# EAGLE design BGHESP32_Base_v1.1 (EAGLE 9.6.2)
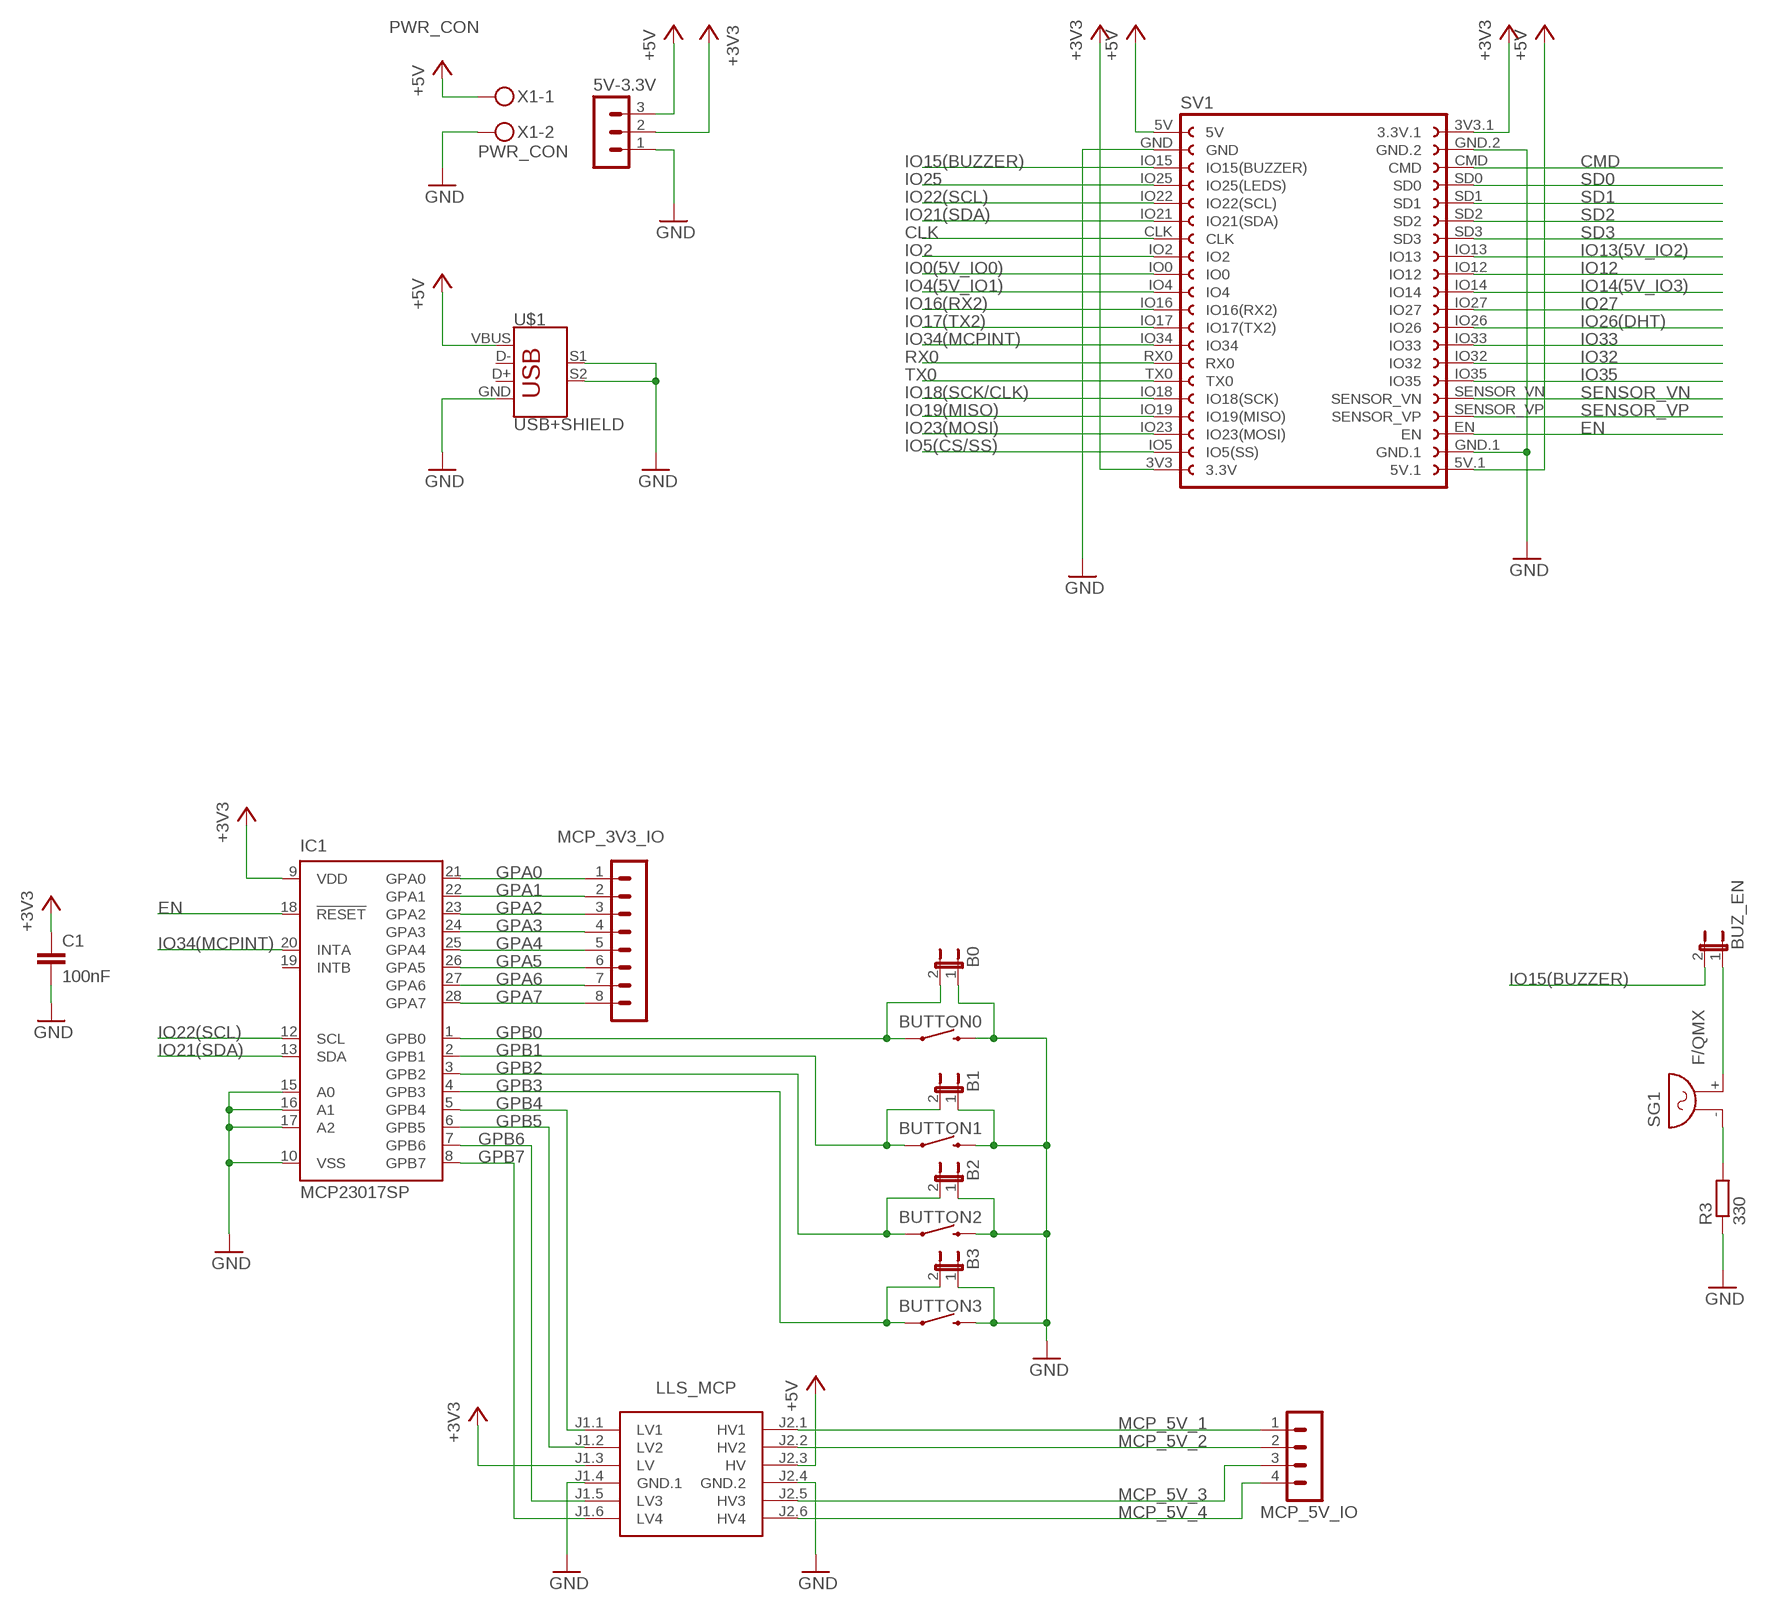
[diagram p0: schematic, sheet 1, part 1 of 2]
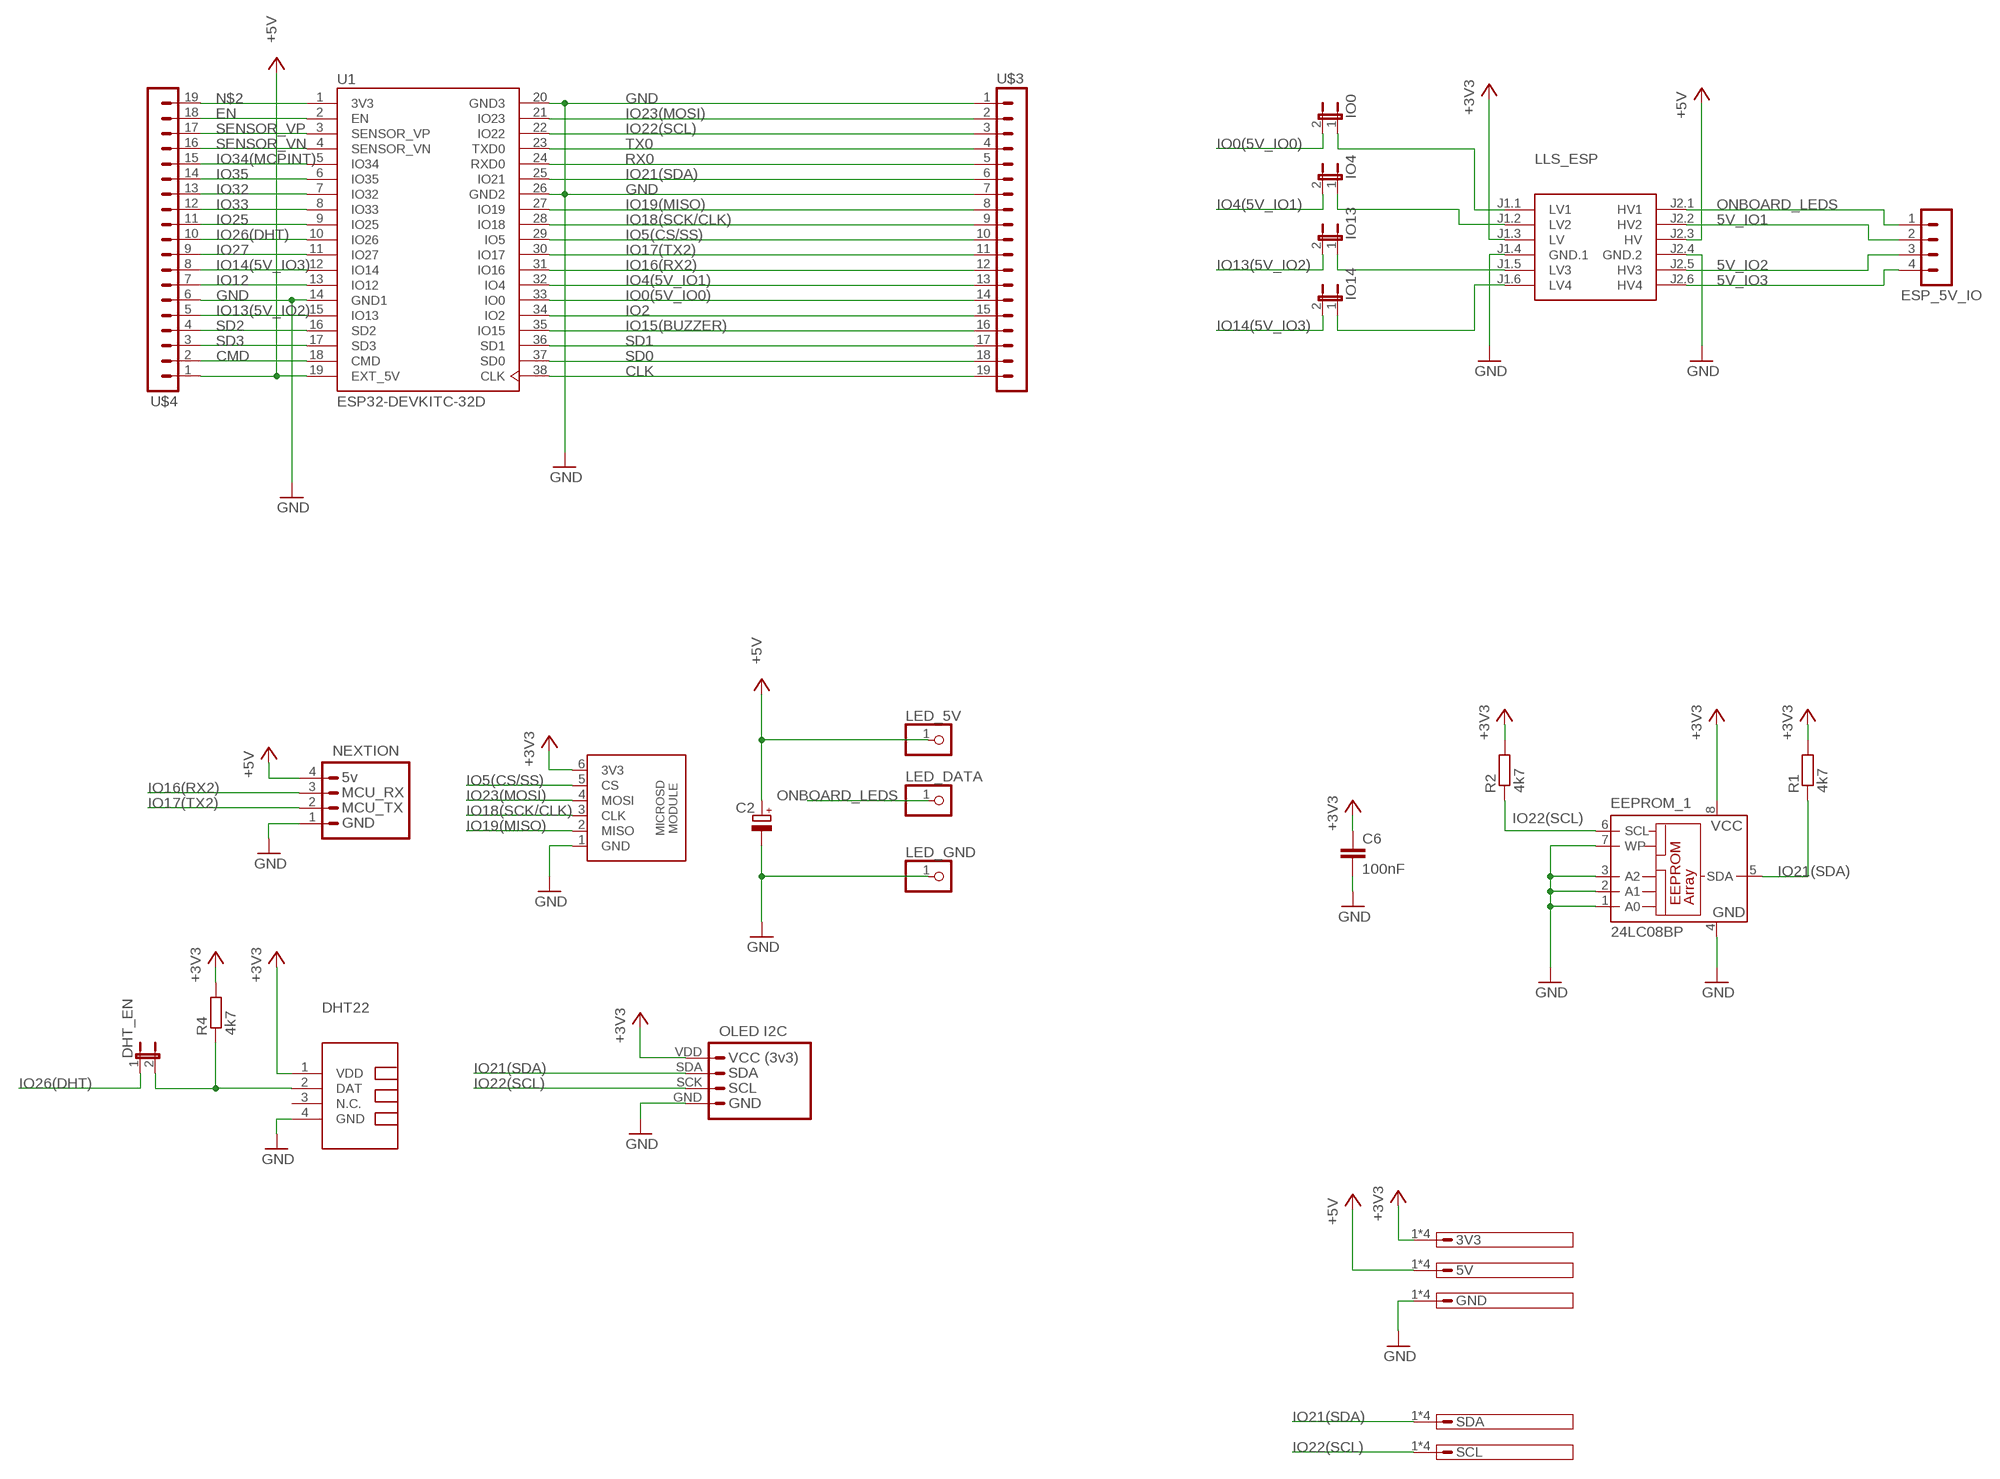
[diagram p1: schematic, sheet 1, part 2 of 2]

## Parts
3V3  IO-OUT-4PIO-OUT-4[  [IO-OUT-4P]
5V  IO-OUT-4PIO-OUT-4[  [IO-OUT-4P]
5V-3.3V  MA03-1  [MA03-1]
B0  JP1E  [JP1]
B1  JP1E  [JP1]
B2  JP1E  [JP1]
B3  JP1E  [JP1]
BUTTON0  MOMENTARY-SWITCH-SPST-PTH-6.0MM  [TACTILE_SWITCH_PTH_6.0MM]
BUTTON1  MOMENTARY-SWITCH-SPST-PTH-6.0MM  [TACTILE_SWITCH_PTH_6.0MM]
BUTTON2  MOMENTARY-SWITCH-SPST-PTH-6.0MM  [TACTILE_SWITCH_PTH_6.0MM]
BUTTON3  MOMENTARY-SWITCH-SPST-PTH-6.0MM  [TACTILE_SWITCH_PTH_6.0MM]
BUZ_EN  JP1E  [JP1]
C1  100nF  C-EU050-025X075  [C050-025X075]
C2  CPOL-EUE5-10.5  [E5-10,5]
C6  100nF  C-EU050-025X075  [C050-025X075]
DHT22  TEMP-HUM-SENSOR-DHT22  [TEMP-HUM-SENSOR-DHT22]
DHT_EN  JP1E  [JP1]
EEPROM_1  24LC08BP  [DIL8]
ESP_5V_IO  MA04-1  [MA04-1]
GND  IO-OUT-4PIO-OUT-4[  [IO-OUT-4P]
IC1  MCP23017SP  [DIL28-3]
IO0  JP1E  [JP1]
IO4  JP1E  [JP1]
IO13  JP1E  [JP1]
IO14  JP1E  [JP1]
LED_5V  PINHD-1X1  [1X01]
LED_DATA  PINHD-1X1  [1X01]
LED_GND  PINHD-1X1  [1X01]
LLS_ESP  LEVEL-SHIFTER-4CH  [LEVEL-SHIFTER-4CH]
LLS_MCP  LEVEL-SHIFTER-4CH  [LEVEL-SHIFTER-4CH]
MCP_3V3_IO  MA08-1  [MA08-1]
MCP_5V_IO  MA04-1  [MA04-1]
R1  4k7  R-EU_0207/10  [0207/10]
R2  4k7  R-EU_0207/10  [0207/10]
R3  330  R-EU_0207/10  [0207/10]
R4  4k7  R-EU_0207/10  [0207/10]
SCL  IO-OUT-4PIO-OUT-4[  [IO-OUT-4P]
SDA  IO-OUT-4PIO-OUT-4[  [IO-OUT-4P]
SG1  F/QMX  [F/QMX]
SV1  DAUGHTERBOARD_CON  [DAUGHTERBOARD_CON]
SV3  NEXTION_CON  [NEXTION_CON]
U1  ESP32-DEVKITC-32D  [MODULE_ESP32-DEVKITC-32D]
U$1  USB+SHIELD  [USB-B-PTH]
U$2  I2C_OLED  [I2C_OLED]
U$3  MA19-1  [MA19-1]
U$4  MA19-1  [MA19-1]
U$5  SDCARD_MODULE  [SDCARD_MODULE]
X1  PWR_CON  MKDSN1,5/2-5,08  [MKDSN1,5/2-5,08]

## Nets
5V_IO1: ESP_5V_IO.2 LLS_ESP.J2.2(HV2)
5V_IO2: ESP_5V_IO.3 LLS_ESP.J2.5(HV3)
5V_IO3: ESP_5V_IO.4 LLS_ESP.J2.6(HV4)
+3V3: 3V3.1 3V3.2 3V3.3 3V3.4 5V-3.3V.2 C1.1 C6.1 DHT22.1(VDD) EEPROM_1.8(VCC) IC1.9(VDD) LLS_ESP.J1.3(LV) LLS_MCP.J1.3(LV) R1.2 R2.2 R4.2 SV1.3V3(3.3V) SV1.3V3.1(3.3V.1) U$2.VDD(VCC) U$5.6(3V3)
+5V: 5V-3.3V.3 5V.1 5V.2 5V.3 5V.4 C2.+ LED_5V.1 LLS_ESP.J2.3(HV) LLS_MCP.J2.3(HV) SV1.5V SV1.5V.1 SV3.4 U1.19(EXT_5V) U$1.VBUS U$4.1 X1.1
CLK: SV1.CLK U1.38(CLK) U$3.19
CMD: SV1.CMD U1.18(CMD) U$4.2
EN: IC1.18(!RESET) SV1.EN U1.2(EN) U$4.18
GND: 5V-3.3V.1 B0.1 B1.1 B2.1 B3.1 BUTTON0.3 BUTTON1.3 BUTTON2.3 BUTTON3.3 C1.2 C2.- C6.2 DHT22.4(GND) EEPROM_1.1(A0) EEPROM_1.2(A1) EEPROM_1.3(A2) EEPROM_1.4(GND) EEPROM_1.7(WP) GND.1 GND.2 GND.3 GND.4 IC1.10(VSS) IC1.15(A0) IC1.16(A1) IC1.17(A2) LED_GND.1 LLS_ESP.J1.4(GND.1) LLS_ESP.J2.4(GND.2) LLS_MCP.J1.4(GND.1) LLS_MCP.J2.4(GND.2) R3.1 SV1.GND SV1.GND.1 SV1.GND.2 SV3.1 U1.14(GND1) U1.20(GND3) U1.26(GND2) U$1.GND U$1.S1 U$1.S2 U$2.GND U$3.1 U$3.7 U$4.6 U$5.1(GND) X1.2
GPA0: IC1.21(GPA0) MCP_3V3_IO.1
GPA1: IC1.22(GPA1) MCP_3V3_IO.2
GPA2: IC1.23(GPA2) MCP_3V3_IO.3
GPA3: IC1.24(GPA3) MCP_3V3_IO.4
GPA4: IC1.25(GPA4) MCP_3V3_IO.5
GPA5: IC1.26(GPA5) MCP_3V3_IO.6
GPA6: IC1.27(GPA6) MCP_3V3_IO.7
GPA7: IC1.28(GPA7) MCP_3V3_IO.8
GPB0: B0.2 BUTTON0.1 IC1.1(GPB0)
GPB1: B1.2 BUTTON1.1 IC1.2(GPB1)
GPB2: B2.2 BUTTON2.1 IC1.3(GPB2)
GPB3: B3.2 BUTTON3.1 IC1.4(GPB3)
GPB4: IC1.5(GPB4) LLS_MCP.J1.1(LV1)
GPB5: IC1.6(GPB5) LLS_MCP.J1.2(LV2)
GPB6: IC1.7(GPB6) LLS_MCP.J1.5(LV3)
GPB7: IC1.8(GPB7) LLS_MCP.J1.6(LV4)
IO0(5V_IO0): IO0.2 SV1.IO0 U1.33(IO0) U$3.14
IO2: SV1.IO2 U1.34(IO2) U$3.15
IO4(5V_IO1): IO4.2 SV1.IO4 U1.32(IO4) U$3.13
IO5(CS/SS): SV1.IO5(IO5(SS)) U1.29(IO5) U$3.10 U$5.5(CS)
IO12: SV1.IO12 U1.13(IO12) U$4.7
IO13(5V_IO2): IO13.2 SV1.IO13 U1.15(IO13) U$4.5
IO14(5V_IO3): IO14.2 SV1.IO14 U1.12(IO14) U$4.8
IO15(BUZZER): BUZ_EN.2 SV1.IO15(IO15(BUZZER)) U1.35(IO15) U$3.16
IO16(RX2): SV1.IO16(IO16(RX2)) SV3.3 U1.31(IO16) U$3.12
IO17(TX2): SV1.IO17(IO17(TX2)) SV3.2 U1.30(IO17) U$3.11
IO18(SCK/CLK): SV1.IO18(IO18(SCK)) U1.28(IO18) U$3.9 U$5.3(CLK)
IO19(MISO): SV1.IO19(IO19(MISO)) U1.27(IO19) U$3.8 U$5.2(MISO)
IO21(SDA): EEPROM_1.5(SDA) IC1.13(SDA) R1.1 SDA.1 SDA.2 SDA.3 SDA.4 SV1.IO21(IO21(SDA)) U1.25(IO21) U$2.SDA U$3.6
IO22(SCL): EEPROM_1.6(SCL) IC1.12(SCL) R2.1 SCL.1 SCL.2 SCL.3 SCL.4 SV1.IO22(IO22(SCL)) U1.22(IO22) U$2.SCK(SCL) U$3.3
IO23(MOSI): SV1.IO23(IO23(MOSI)) U1.21(IO23) U$3.2 U$5.4(MOSI)
IO25: SV1.IO25(IO25(LEDS)) U1.9(IO25) U$4.11
IO26(DHT): DHT_EN.1 SV1.IO26 U1.10(IO26) U$4.10
IO27: SV1.IO27 U1.11(IO27) U$4.9
IO32: SV1.IO32 U1.7(IO32) U$4.13
IO33: SV1.IO33 U1.8(IO33) U$4.12
IO34(MCPINT): IC1.20(INTA) SV1.IO34 U1.5(IO34) U$4.15
IO35: SV1.IO35 U1.6(IO35) U$4.14
MCP_5V_1: LLS_MCP.J2.1(HV1) MCP_5V_IO.1
MCP_5V_2: LLS_MCP.J2.2(HV2) MCP_5V_IO.2
MCP_5V_3: LLS_MCP.J2.5(HV3) MCP_5V_IO.3
MCP_5V_4: LLS_MCP.J2.6(HV4) MCP_5V_IO.4
N$1: R3.2 SG1.-
N$2: U1.1(3V3) U$4.19
N$11: IO0.1 LLS_ESP.J1.1(LV1)
N$12: DHT22.2(DAT) DHT_EN.2 R4.1
N$18: IO4.1 LLS_ESP.J1.2(LV2)
N$21: BUZ_EN.1 SG1.+
N$23: IO13.1 LLS_ESP.J1.5(LV3)
N$24: IO14.1 LLS_ESP.J1.6(LV4)
ONBOARD_LEDS: ESP_5V_IO.1 LED_DATA.1 LLS_ESP.J2.1(HV1)
RX0: SV1.RX0 U1.24(RXD0) U$3.5
SD0: SV1.SD0 U1.37(SD0) U$3.18
SD1: SV1.SD1 U1.36(SD1) U$3.17
SD2: SV1.SD2 U1.16(SD2) U$4.4
SD3: SV1.SD3 U1.17(SD3) U$4.3
SENSOR_VN: SV1.SENSOR_VN U1.4(SENSOR_VN) U$4.16
SENSOR_VP: SV1.SENSOR_VP U1.3(SENSOR_VP) U$4.17
TX0: SV1.TX0 U1.23(TXD0) U$3.4
Unconnected: DHT22.3(N.C.) IC1.19(INTB) U$1.D+ U$1.D-

## Library data of the parts
3V3 5V GND SCL SDA = BGH:IO-OUT-4P
5V-3.3V = con-lstb2:MA03-1: PIN HEADER; OC_FARNELL: unknown; OC_NEWARK: unknown
B0 B1-B3 BUZ_EN DHT_EN IO0 IO4 IO13 IO14 = jumper:JP1E: JUMPER
BUTTON0 BUTTON1-BUTTON3 = SparkFun-Switches:MOMENTARY-SWITCH-SPST: Momentary Switch (Pushbutton) - SPST Normally-open (NO) SPST momentary switches (buttons, pushbuttons). Variants PTH-12MM - 12mm square, through-hole Momentary Pushbutton Switch - 12mm Square <https://www.sparkfun.com/products/9190> (COM-09190) PTH-6.0MM, PTH-6.0MM-KIT - 6.0mm square, through-hole Mini Pushbutton Switch <https://www.sparkfun.com/products/97> (COM-00097) KIT package intended for soldering kit's - only one side of pads' copper is exposed. PTH-RIGHT-ANGLE-KIT - Right-angle, through-hole Right Angle Tactile Button <https://www.sparkfun.com/products/10791> - Used on SparkFun BigTime Watch Kit <https://www.sparkfun.com/products/11734> SMD-12MM - 12mm square, surface-mount Tactile Button - SMD (12mm) <https://www.sparkfun.com/products/12993> (COM-12993) Used on SparkFun PicoBoard <https://www.sparkfun.com/products/11888> SMD-4.5MM - 4.5mm Square Trackball Switch Used on SparkFun Blackberry Trackballer Breakout <https://www.sparkfun.com/products/13169> SMD-4.6MMX2.8MM - 4.60mm x 2.80mm, surface mount Used on SparkFun SAMD21 Mini Breakout <https://www.sparkfun.com/products/13664> SMD-5.2MM, SMD-5.2-REDUNDANT - 5.2mm square, surface-mount Mini Pushbutton Switch - SMD <https://www.sparkfun.com/products/8720> (COM-08720) Used on Arduino Pro Mini <https://www.sparkfun.com/products/11114> REDUNDANT package connects both switch circuits together SMD-6.0X3.5MM - 6.0 x 3.5mm, surface mount Momentary Reset Switch SMD <https://www.sparkfun.com/products/8229> (COM-08229) SMD-6.2MM-TALL - 6.2mm square, surface mount Tactile Button - SMD (6mm) <https://www.sparkfun.com/products/12992> Used on SparkFun Digital Sandbox <https://www.sparkfun.com/products/12651> SMD-RIGHT-ANGLE - Right-angle, surface mount Used on SparkFun Block for Intel® Edison - Arduino <https://www.sparkfun.com/products/13036>; PROD_ID: SWCH-08441; SF_SKU: COM-00097
C1 C6 = rcl:C-EU: CAPACITOR, European symbol; SPICEPREFIX: C
C2 = rcl:CPOL-EU: POLARIZED CAPACITOR, European symbol; SPICEPREFIX: C
DHT22 = diy-modules:TEMP-HUM-SENSOR-DHT22: DHT22 - digital humidity & temperature sensor Also known as: AM2302 AM2302 datasheet available here: http://akizukidenshi.com/download/ds/aosong/AM2302.pdf Click here to find device on ebay.com <http://www.ebay.com/sch/dht22+digital+sensor>
EEPROM_1 = microchip:24*: Serial EEPROM I2C; MF: MICROCHIP; MPN: 24LC08B/P; OC_FARNELL: 1084245; OC_NEWARK: 96K4073
ESP_5V_IO MCP_5V_IO = con-lstb2:MA04-1: PIN HEADER; OC_FARNELL: unknown; OC_NEWARK: unknown
IC1 = microchip:MCP23017: http://ww1.microchip.com/downloads/en/DeviceDoc/21952a.pdf Source: http://ww1.microchip.com/downloads/en/DeviceDoc/21952a.pdf; MF: MICROCHIP; MPN: MCP23017-E/SP; OC_FARNELL: 1332088; OC_NEWARK: 31K2959
LED_5V LED_DATA LED_GND = adafruit:PINHD-1X1: Pin header 1x1 for 0.1" spacing With round pins
LLS_ESP LLS_MCP = diy-modules:LEVEL-SHIFTER-4CH: 4-Channel Bi-Directional Logic Level Converter based on BSS128 transistors Click here to find device on ebay.com <http://www.ebay.com/sch/i2c+logic+converter+module>
MCP_3V3_IO = con-lstb2:MA08-1: PIN HEADER; OC_FARNELL: unknown; OC_NEWARK: unknown
R1-R4 = rcl:R-EU_: RESISTOR, European symbol; SPICEPREFIX: R
SG1 = buzzer:F/QMX: BUZZER Source: Buerklin; OC_FARNELL: unknown; OC_NEWARK: unknown
SV1 = BGH:DAUGHTERBOARD_CON: BGHPCB32_DAUGHTER_CON
SV3 = BGH:NEXTION_CON: PIN HEADER; OC_FARNELL: unknown; OC_NEWARK: unknown
U1 = ESP32-DEVKITC-32D:ESP32-DEVKITC-32D: Eval Board For Esp-Wroom-32; AVAILABILITY: Unavailable; DESCRIPTION: - Transceiver; 802.11 b/g/n _Wi-Fi, WiFi, WLAN_, Bluetooth® Smart Ready 4.x Dual Mode For Use With ESP-WROOM-32; MF: Espressif Systems; MP: ESP32-DEVKITC-32D; PACKAGE: None; PRICE: None
U$1 = SparkFun-Retired:USB+SHIELD: USB+Shield USB connector with shield pins connectable
U$2 = BGH:I2C_OLED: OLED I2C 128x64 (https://www.aliexpress.com/item/32896971385.html?spm=a2g0s.9042311.0.0.17e74c4dSP5ZpN)
U$3 U$4 = BGH:MA19-1
U$5 = BGH:SDCARD_MODULE: micro sd card module
X1 = con-phoenix-508:MKDSN1,5/2-5,08: MKDSN 1,5/ 2-5,08 Printklemme Nennstrom: 13,5 A Nennspannung: 250 V Rastermaß: 5,08 mm Polzahl: 2 Anschlussart: Schraubanschluss Montage: Löten Anschlussrichtung Leiter/Platine: 0 ° Artikelnummer: 1729128 Source: http://eshop.phoenixcontact.com .. 1729128.pdf

## Board
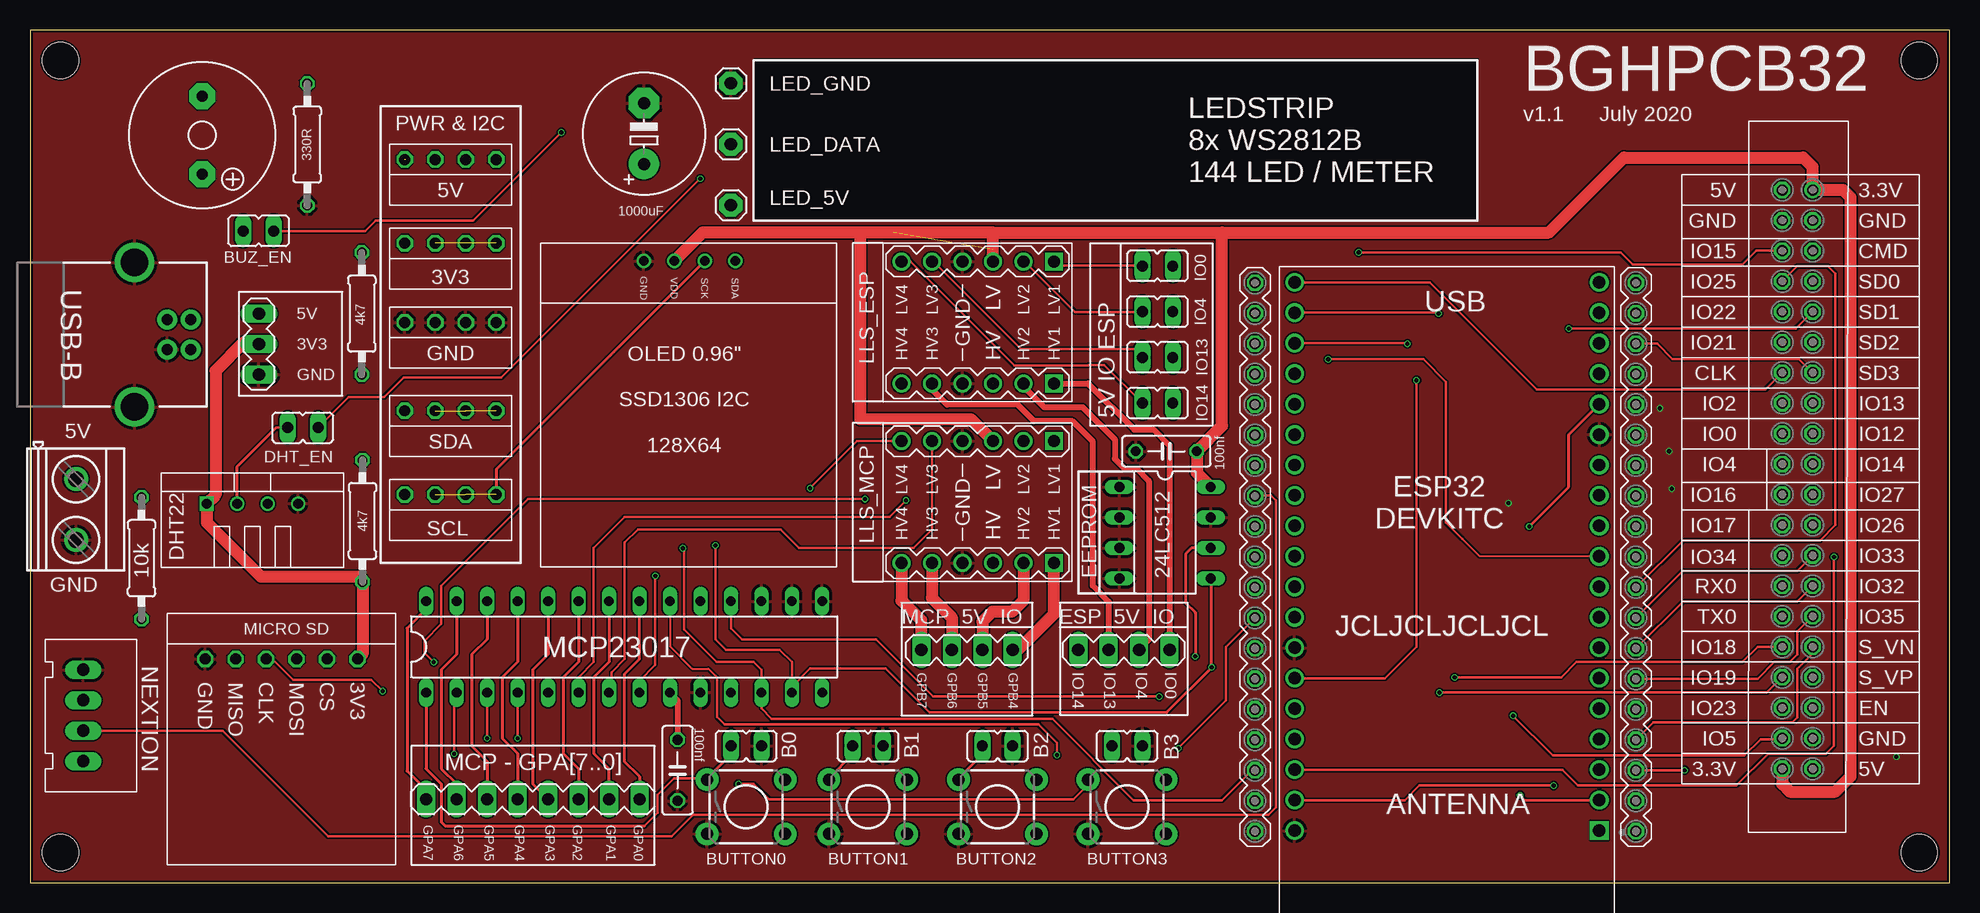
[diagram p2: board, top side]
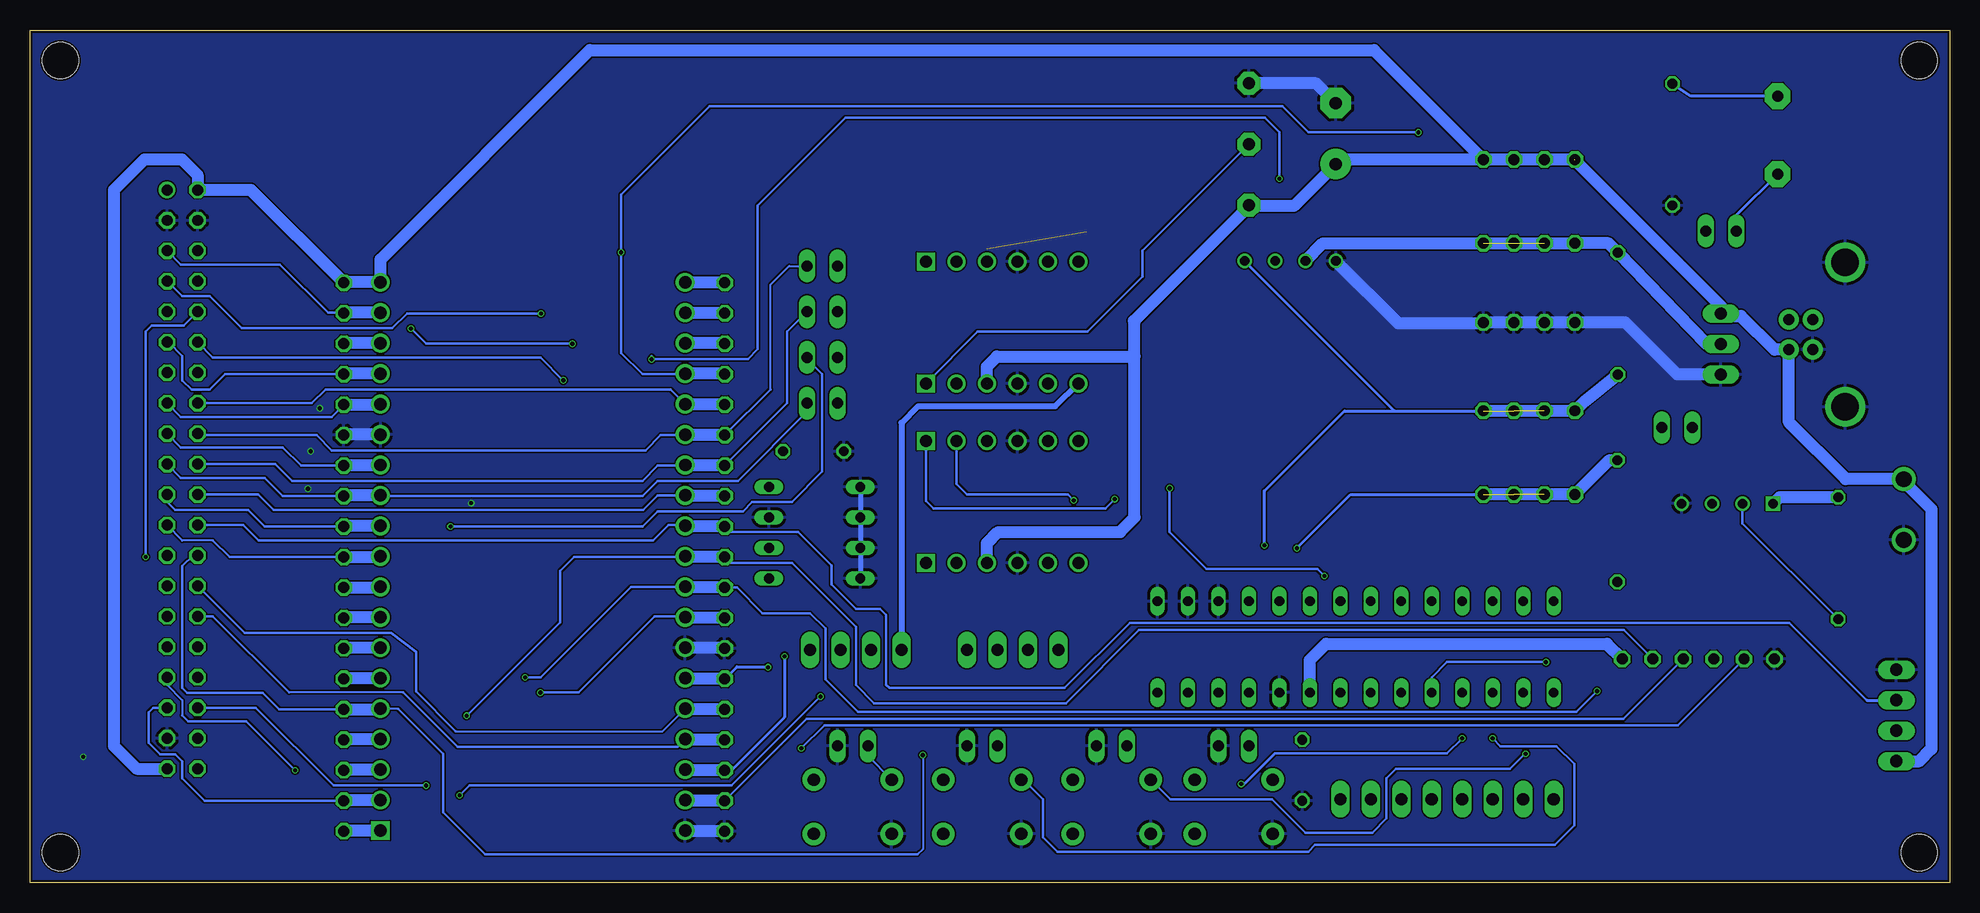
[diagram p3: board, bottom side, seen from below]

Size 160.02 x 71.12 mm. Coordinates in mm from the lower left corner, seen from the top.
Outline: 0,0 160.02,0 160.02,71.12 0,71.12 0,0
Copper layers (1*16): Top 0.035559375mm / dielectric 1.6mm / Bottom 0.035559375mm
Design rules "jlcpcb2layer": minimum track width 5mil, minimum drill 12mil, track to track 5mil, track to pad 5mil, pad to pad 5mil, via to via 5mil, smd to smd 5mil, copper to edge 8mil, drill to drill 6mil, minimum pad ring 5mil, minimum via ring 3mil, stop-mask expansion 2.5mil, vias tented up to drill 0mil, thermal gap 10mil
Holes 3 mm at 2.54,68.58 2.54,2.54 157.48,2.54 157.48,68.58

### Footprints (pad centres in the part's own frame; a part is rotated, then mirrored left to right if it is on the bottom)
IO-OUT-4P = drill 0.914 octagon: 1 3.81,0; 2 1.27,0; 3 -1.27,0; 4 -3.81,0
MA03-1 = drill 1.016 long: 1 -2.54,0; 2 0,0; 3 2.54,0
JP1 = drill 0.914 long: 1 0,-1.27; 2 0,1.27
TACTILE_SWITCH_PTH_6.0MM = drill 1.016 pad 1.88: 1 -3.251,2.261; 2 3.251,2.261; 3 -3.251,-2.261; 4 3.251,-2.261
C050-025X075 = drill 0.813 octagon: 1 -2.54,0; 2 2.54,0
E5-10,5 = drill 1.016 pad 2.54: + -2.54,0 | drill 1.016 pad 2.54 octagon: - 2.54,0
TEMP-HUM-SENSOR-DHT22 = drill 0.8 square: 1 -3.81,0 | drill 0.8: 2 -1.27,0; 3 1.27,0; 4 3.81,0
DIL8 = drill 0.813 long: 1 -3.81,-3.81; 2 -1.27,-3.81; 3 1.27,-3.81; 4 3.81,-3.81; 5 3.81,3.81; 6 1.27,3.81; 7 -1.27,3.81; 8 -3.81,3.81
MA04-1 = drill 1.016 long: 1 -3.81,0; 2 -1.27,0; 3 1.27,0; 4 3.81,0
DIL28-3 = drill 0.813 long: 1 -16.51,-3.81; 2 -13.97,-3.81; 3 -11.43,-3.81; 4 -8.89,-3.81; 5 -6.35,-3.81; 6 -3.81,-3.81; 7 -1.27,-3.81; 8 1.27,-3.81; 9 3.81,-3.81; 10 6.35,-3.81; 11 8.89,-3.81; 12 11.43,-3.81; 13 13.97,-3.81; 14 16.51,-3.81; 15 16.51,3.81; 16 13.97,3.81; 17 11.43,3.81; 18 8.89,3.81; 19 6.35,3.81; 20 3.81,3.81; 21 1.27,3.81; 22 -1.27,3.81; 23 -3.81,3.81; 24 -6.35,3.81; 25 -8.89,3.81; 26 -11.43,3.81; 27 -13.97,3.81; 28 -16.51,3.81
1X01 = drill 1.016 pad 1.93 octagon: 1 0,0
LEVEL-SHIFTER-4CH = drill 1 square: J1.1 -5.08,6.35; J2.1 5.08,6.35 | drill 1: J1.2 -5.08,3.81; J1.3 -5.08,1.27; J1.4 -5.08,-1.27; J1.5 -5.08,-3.81; J1.6 -5.08,-6.35; J2.2 5.08,3.81; J2.3 5.08,1.27; J2.4 5.08,-1.27; J2.5 5.08,-3.81; J2.6 5.08,-6.35
MA08-1 = drill 1.016 long: 1 -8.89,0; 2 -6.35,0; 3 -3.81,0; 4 -1.27,0; 5 1.27,0; 6 3.81,0; 7 6.35,0; 8 8.89,0
0207/10 = drill 0.813 octagon: 1 -5.08,0; 2 5.08,0
F/QMX = drill 0.914 pad 2.159 octagon: + 3.251,0; - -3.251,0
DAUGHTERBOARD_CON = drill 0.914: 3V3 1.27,24.13 | drill 0.914 octagon: 3V3.1 -1.27,-24.13; 5V -1.27,24.13; 5V.1 1.27,-24.13; CLK -1.27,8.89; CMD 1.27,19.05; EN 1.27,-19.05; GND -1.27,21.59; GND.1 1.27,21.59; GND.2 1.27,-21.59; IO0 -1.27,3.81; IO2 -1.27,6.35; IO4 -1.27,1.27; IO5 -1.27,-21.59; IO12 1.27,3.81; IO13 1.27,6.35; IO14 1.27,1.27; IO15 -1.27,19.05; IO16 -1.27,-1.27; IO17 -1.27,-3.81; IO18 -1.27,-13.97; IO19 -1.27,-16.51; IO21 -1.27,11.43; IO22 -1.27,13.97; IO23 -1.27,-19.05; IO25 -1.27,16.51; IO26 1.27,-3.81; IO27 1.27,-1.27; IO32 1.27,-8.89; IO33 1.27,-6.35; IO34 -1.27,-6.35; IO35 1.27,-11.43; RX0 -1.27,-8.89; SD0 1.27,16.51; SD1 1.27,13.97; SD2 1.27,11.43; SD3 1.27,8.89; SENSOR_VN 1.27,-13.97; SENSOR_VP 1.27,-16.51; TX0 -1.27,-11.43
NEXTION_CON = drill 1.016 long: 1 -3.81,0; 2 -1.27,0; 3 1.27,0; 4 3.81,0
MODULE_ESP32-DEVKITC-32D = drill 1.04 square: 1 -12.7,19.76 | drill 1.04: 2 -12.7,17.22; 3 -12.7,14.68; 4 -12.7,12.14; 5 -12.7,9.6; 6 -12.7,7.06; 7 -12.7,4.52; 8 -12.7,1.98; 9 -12.7,-0.56; 10 -12.7,-3.1; 11 -12.7,-5.64; 12 -12.7,-8.18; 13 -12.7,-10.72; 14 -12.7,-13.26; 15 -12.7,-15.8; 16 -12.7,-18.34; 17 -12.7,-20.88; 18 -12.7,-23.42; 19 -12.7,-25.96; 20 12.7,19.76; 21 12.7,17.22; 22 12.7,14.68; 23 12.7,12.14; 24 12.7,9.6; 25 12.7,7.06; 26 12.7,4.52; 27 12.7,1.98; 28 12.7,-0.56; 29 12.7,-3.1; 30 12.7,-5.64; 31 12.7,-8.18; 32 12.7,-10.72; 33 12.7,-13.26; 34 12.7,-15.8; 35 12.7,-18.34; 36 12.7,-20.88; 37 12.7,-23.42; 38 12.7,-25.96
USB-B-PTH = drill 0.914 pad 1.676: D+ 0,1.25; D- 1.981,1.25; GND 0,-1.25; VBUS 1.981,-1.25 | drill 2.286: S1 -2.718,-6.02; S2 -2.718,6.02
I2C_OLED = drill 0.8: GND 8.62,-1.47; SCK 13.7,-1.47; SDA 16.24,-1.47; VDD 11.16,-1.47
MA19-1 = drill 0.914 octagon: 1 2.54,25.4; 2 2.54,22.86; 3 2.54,20.32; 4 2.54,17.78; 5 2.54,15.24; 6 2.54,12.7; 7 2.54,10.16; 8 2.54,7.62; 9 2.54,5.08; 10 2.54,2.54; 11 2.54,0; 12 2.54,-2.54; 13 2.54,-5.08; 14 2.54,-7.62; 15 2.54,-10.16; 16 2.54,-12.7; 17 2.54,-15.24; 18 2.54,-17.78; 19 2.54,-20.32
SDCARD_MODULE = drill 0.914 octagon: 1 3.175,-3.81; 2 5.715,-3.81; 3 8.255,-3.81; 4 10.795,-3.81; 5 13.335,-3.81; 6 15.875,-3.81
MKDSN1,5/2-5,08 = drill 1.3 pad 2: 1 -2.561,0.025; 2 2.519,0.025

### Placement (x,y rotation side)
3V3  35.05,53.34 0 top
5V  35.05,60.32 0 top
5V-3.3V  19.08,44.94 90 top
B0  59.69,11.43 90 top
B1  69.85,11.43 90 top
B2  80.64,11.43 90 top
B3  91.44,11.43 90 top
BUTTON0  59.69,6.35 0 top
BUTTON1  69.85,6.35 0 top
BUTTON2  80.64,6.35 0 top
BUTTON3  91.44,6.35 0 top
BUZ_EN  19.05,54.36 270 top
C1  53.98,9.4 270 top
C2  51.18,62.48 90 top
C6  94.72,35.99 180 top
DHT22  18.54,31.62 0 top
DHT_EN  22.73,37.97 90 top
EEPROM_1  94.61,29.21 270 top
ESP_5V_IO  91.19,19.43 180 top
GND  35.05,46.74 0 top
IC1  49.53,19.69 0 top
IO0  93.98,51.43 270 top
IO4  93.98,47.62 270 top
IO13  93.98,43.81 270 top
IO14  93.98,40 270 top
LED_5V  58.42,56.52 0 top
LED_DATA  58.42,61.59 0 top
LED_GND  58.42,66.67 0 top
LLS_ESP  78.99,46.74 270 top
LLS_MCP  78.99,31.75 270 top
MCP_3V3_IO  41.91,6.99 180 top
MCP_5V_IO  78.11,19.43 180 top
R1  27.66,47.47 90 top
R2  27.71,30.18 270 top
R3  23.11,61.57 90 top
R4  9.3,27.08 90 top
SCL  35.05,32.38 0 top
SDA  35.05,39.37 0 top
SG1  14.35,62.36 270 top
SV1  147.32,33.66 0 top
SV3  4.45,13.97 270 top
U1  118.11,24.13 180 top
U$1  11.43,45.72 0 top
U$2  42.55,53.34 0 top
U$3  104.65,29.72 180 top
U$4  131.32,24.64 0 top
U$5  11.43,22.48 0 top
X1  3.81,31.12 270 top

### Tracks (layer width: path | path; a pad name or v marks a point on that pad's centre or on a via)
5V_IO1
  Top 0.508: ESP_5V_IO.2 92.46,19.51 93.27,20.32 93.27,33.53 92.25,34.54 91.24,34.54 90.42,35.36 90.42,36.98 87.76,39.65 84.56,39.65 82.8,41.4 LLS_ESP.J2.2
5V_IO2
  Top 0.508: ESP_5V_IO.3 89.92,23.47 88.59,24.79 88.59,36.8 86.89,38.51 83.67,38.51 82.3,39.88 76.45,39.88 75.18,41.15 LLS_ESP.J2.5
5V_IO3
  Bottom 0.508: ESP_5V_IO.4 87.38,38.35 85.98,39.75 74.55,39.75 LLS_ESP.J2.6
+3V3  (3 unrouted)
  Top 0.508: IC1.9 53.98,15.24 C1.1
  Top 0.61: 17.83,45.09 18.94,45.09 5V-3.3V.2
  Top 1.016: 17.83,45.09 15.47,42.72 15.47,32.36 DHT22.1 14.73,30.05 19.25,25.53 27.28,25.53 R2.2 27.71,19.07 U$5.6 | U$2.VDD 56.09,54.25 71.97,54.25 | LLS_MCP.J1.3 78.44,38.66 69.22,38.66 69.22,54.25 80.26,54.25 LLS_ESP.J1.3 | SV1.3V3.1 146.05,8.25 146.69,7.62 150.5,7.62 151.76,8.89 151.76,57.15 151.13,57.78 SV1.3V3 148.59,59.69 147.8,60.48 132.87,60.48 126.62,54.23 99.36,54.23 | LLS_ESP.J1.3 80.26,52.86 | 99.36,54.23 80.11,54.23 80.26,54.08 LLS_ESP.J1.3 | EEPROM_1.8 97.26,34.19 C6.1 99.36,38.1 99.36,54.23
  Bottom 1.016: 5V-3.3V.2 20.3,44.94 R1.2 28.45,53.34 3V3.4 | 3V3.3 3V3.4 | U$2.VDD 52.23,53.34 3V3.4 | IC1.9 53.34,18.59 51.99,19.94 28.57,19.94 U$5.6 | R4.2 14.2,32.16 DHT22.1
+5V  (2 unrouted)
  Bottom 0.61: 133.81,50.09 U$4.1
  Bottom 1.016: 31.29,60.3 19.08,48.09 5V-3.3V.3 18.88,47.28 17.41,47.28 14.6,44.47 U$1.VBUS 13.41,38.41 8.68,33.68 X1.1 3.83,33.47 1.52,31.16 1.52,11.18 2.54,10.16 SV3.4 | 58.42,56.44 68,46.86 67.94,46.8 67.94,43.89 | 58.42,56.44 LED_5V.1 58.42,56.64 | LLS_MCP.J2.3 80.26,28.32 79.32,29.26 69.16,29.26 67.94,30.48 67.94,43.89 | SV1.5V.1 151.13,9.53 153.03,11.43 153.03,57.78 150.5,60.32 147.34,60.32 146.05,59.03 SV1.5V 141.6,57.78 U$4.1 | 133.81,50.09 U1.19 130.81,51.99 113.36,69.44 47.98,69.44 5V.1 | 5V.4 5V.3 5V.2 5V.1 | 58.42,56.44 54.69,56.44 C2.+ 50.78,60.34 38.88,60.34 5V.1 | 67.94,43.89 79.43,43.89 80.26,43.05 LLS_ESP.J2.3
CLK
  Top 0.203: SV1.CLK 144.65,41.15 125.59,41.15 116.7,50.04 105.46,50.04 U1.38
  Bottom 0.61: 105.36,50.04 U1.38
  Bottom 1.016: U$3.19 105.36,50.04
CMD
  Bottom 0.203: SV1.CMD 147.45,51.56 139.19,51.56 135.18,47.55 133.81,47.55
  Bottom 0.508: 133.81,47.55 U$4.2
  Bottom 1.016: U1.18 133.81,47.55
CUTOUT
  cutout Top: 120.7,55.27 120.7,68.68 60.35,68.68 60.35,55.27
EN  (via drill 0.35)
  Top 0.203: IC1.18 58.42,21.23 59.33,20.32 70.51,20.32 75.29,15.54 v94.13,15.54 | v124.21,7.31 124.61,6.91 U1.2
  Bottom 0.203: v124.21,7.31 123.39,8.13 101.55,8.13 v94.13,15.54 | U$4.18 145.44,6.86 147.32,8.74 147.32,10.16 147.9,10.74 149.17,10.74 150.11,11.68 150.11,14.22 149.73,14.61 SV1.EN
  Bottom 1.016: U1.2 133.81,6.91 U$4.18
GND  (via drill 0.35)
  Bottom 0.406: EEPROM_1.1 EEPROM_1.4
  Bottom 0.508: 133.81,37.39 U$4.6 | U$3.7 102.16,19.61 | 105.36,4.32 U1.20
  Bottom 1.016: 5V-3.3V.1 22.72,42.4 27.05,46.74 GND.4 GND.3 GND.2 GND.1 38.94,46.66 45.96,46.66 U$2.GND | U1.14 133.81,37.39 | 102.16,19.61 U1.26 | U$3.1 105.36,4.32 | C2.- 52.83,66.67 LED_GND.1
  other vias: 155.57,10.52 123.24,31.67 136.63,35.99 135.86,39.57 136.86,32.87
  pour Bottom: 0,71.12 160.02,71.12 160.02,0 0,0
  pour Top: 0,71.12 160.02,71.12 160.02,0 0,0
GPA0
  Top 0.254: IC1.21 50.77,23.47 50.77,18.64 49.53,17.4 49.53,10.16 50.8,8.89 MCP_3V3_IO.1
GPA1
  Top 0.254: IC1.22 48.26,18.41 46.99,17.14 46.99,10.79 48.26,9.53 MCP_3V3_IO.2
GPA2
  Top 0.254: IC1.23 45.72,18.41 44.45,17.14 44.45,10.79 45.72,9.53 MCP_3V3_IO.3
GPA3
  Top 0.254: IC1.24 43.18,19.05 41.91,17.78 41.91,8.25 MCP_3V3_IO.4
GPA4
  Top 0.254: IC1.25 40.64,18.41 39.37,17.14 39.37,12.07 40.64,10.79 MCP_3V3_IO.5
GPA5
  Top 0.254: IC1.26 38.1,20.32 36.83,19.05 36.83,11.43 38.1,10.16 MCP_3V3_IO.6
GPA6
  Top 0.254: IC1.27 35.56,19.05 34.29,17.78 34.29,9.53 35.56,8.25 MCP_3V3_IO.7
GPA7
  Top 0.203: IC1.28 33.02,22.84 | 33.02,7.75 MCP_3V3_IO.8
  Top 0.254: 33.02,22.84 31.42,21.23 31.42,9.35 33.02,7.75
GPB0
  Top 0.203: B0.2 58.42,10.72 | BUTTON0.1 56.44,8.74 53.7,8.74 52.32,7.37 52.32,5.84 51.23,4.75
  Top 0.254: 58.42,10.72 56.44,8.74 | IC1.1 33.02,9.53 34.29,8.25 34.29,5.08 34.62,4.75 51.23,4.75
GPB1  (via drill 0.35)
  Top 0.203: B1.2 68.58,10.72 | 66.6,8.74 BUTTON1.1 | IC1.2 35.35,15.66 v35.35,10.77
  Top 0.254: 68.58,10.72 66.6,8.74
  Bottom 0.203: BUTTON1.1 64.97,6.99 56.52,6.99 53.72,4.19 48.13,4.19 46.94,5.38 46.94,8.74 46.15,9.53 36.68,9.53 35.43,10.77 v35.35,10.77
GPB2  (via drill 0.35)
  Top 0.203: B2.2 79.38,10.72 | 77.39,8.74 BUTTON2.1 | IC1.3 v38.1,12.07
  Top 0.254: 79.38,10.72 77.39,8.74
  Bottom 0.203: BUTTON2.1 77.19,8.61 75.56,6.99 75.56,3.81 74.37,2.62 53.47,2.62 52.91,3.17 32.92,3.17 31.3,4.79 31.3,9.92 32.79,11.41 37.44,11.41 v38.1,12.07
GPB3  (via drill 0.35)
  Top 0.152: 87,6.99 88.19,8.18 BUTTON3.1
  Top 0.203: IC1.4 v40.64,12.07 | v59.05,8.25 60.33,8.25 61.59,6.99 87,6.99
  Bottom 0.203: 56.26,10.79 41.91,10.79 v40.64,12.07 | 58.8,8.25 v59.05,8.25 | B3.2 90.17,10.59 BUTTON3.1
  Bottom 0.254: 58.8,8.25 56.26,10.79
GPB4  (via drill 0.35)
  Top 0.203: v33.66,18.41 32.89,19.18 32.89,20.19 34.29,21.59 34.29,24.77 41.53,32 v69.6,32
  Bottom 0.203: IC1.5 43.18,17.14 41.91,18.41 v33.66,18.41 | LLS_MCP.J1.1 85.34,31.85 84.71,31.22 70.38,31.22 v69.6,32
GPB5  (via drill 0.35)
  Top 0.203: IC1.6 45.72,17.14 46.99,18.41 46.99,27.94 49.55,30.51 71.63,30.51 v73.03,31.9
  Bottom 0.203: v73.03,31.9 73.51,32.38 81.92,32.38 82.8,33.27 LLS_MCP.J1.2
GPB6
  Top 0.203: IC1.7 48.46,16.08 48.46,17.58 49.58,18.69 49.58,28.4 50.67,29.49 62.56,29.49 64.11,27.94 73.66,27.94 75.18,29.46 LLS_MCP.J1.5
GPB7  (via drill 0.35)
  Top 0.203: 50.8,16.87 52.12,18.19 v52.12,25.6 | v65.02,32.92 68.94,36.83 LLS_MCP.J1.6
  Top 0.254: IC1.8 50.8,16.87
  Bottom 0.203: v52.12,25.6 52.7,26.19 61.95,26.19 65.02,29.26 v65.02,32.92
IO0(5V_IO0)
  Bottom 0.152: 98.3,41.15 98.3,49.89 96.75,51.43 IO0.2
  Bottom 0.203: SV1.IO0 145.92,37.34 136.14,37.34 134.87,36.07 108.71,36.07 107.44,37.34 105.36,37.34 | U$3.14 98.3,41.15
  Bottom 0.508: 105.36,37.34 U1.33
  Bottom 1.016: U$3.14 105.36,37.34
IO2
  Bottom 0.203: SV1.IO2 136.53,40 135.38,41.15 106.63,41.15 105.36,39.88
  Bottom 0.508: 105.36,39.88 U1.34
  Bottom 1.016: U$3.15 105.36,39.88
IO4(5V_IO1)
  Bottom 0.152: 96.9,45.97 IO4.2
  Bottom 0.203: SV1.IO4 139.57,34.92 138.18,33.53 108.97,33.53 107.7,34.8 105.36,34.8 | U$3.13 96.9,40 96.9,45.97
  Bottom 0.508: 105.36,34.8 U1.32
  Bottom 1.016: U$3.13 105.36,34.8
IO5(CS/SS)  (via drill 0.35)
  Top 0.203: SV1.IO5 145.97,11.99 144.26,11.99 142.91,10.64 126.92,10.64 v123.62,13.95
  Bottom 0.203: U$3.10 101.6,26.67 96.52,26.67 91.19,21.34 91.19,16.51 89.66,14.99 73.66,14.99 67.56,21.08 27.18,21.08 U$5.5 | v123.62,13.95 115.82,21.74 115.82,26.01 114.66,27.18 105.36,27.18
  Bottom 0.508: 105.36,27.18 U1.29
  Bottom 1.016: U$3.10 105.36,27.18
IO12
  Bottom 0.203: SV1.IO12 147.45,36.32 138.94,36.32 137.41,34.8 U$4.7 133.81,34.85
  Bottom 1.016: 133.81,34.85 U1.13
IO13(5V_IO2)  (via drill 0.35)
  Top 0.254: v124.97,29.72 128.27,33.02 128.27,37.39 U1.15
  Bottom 0.152: IO13.2 95.25,43.69
  Bottom 0.203: SV1.IO13 147.45,38.86 134.87,38.86 U$4.5 | 95.25,43.69 93.98,42.42 93.98,34.29 96.52,31.75 99.82,31.75 100.58,30.99 107.7,30.99 108.97,29.72 v124.97,29.72
  Bottom 0.508: 130.86,39.88 U1.15
  Bottom 1.016: U$4.5 130.86,39.88
IO14(5V_IO3)
  Bottom 0.152: IO14.2 95.25,39.29
  Bottom 0.203: SV1.IO14 147.45,33.78 140.46,33.78 138.94,32.26 U$4.8 133.81,32.31 | 95.25,39.29 101.02,33.53 107.7,33.53 108.97,32.26 130.76,32.26 U1.12
  Bottom 1.016: U1.12 133.81,32.31
IO15(BUZZER)  (via drill 0.35)
  Top 0.203: BUZ_EN.2 27.94,54.36 28.83,55.24 36.96,55.24 v44.3,62.59 | SV1.IO15 143.89,52.7 142.75,51.56 133.6,51.56 132.59,52.58 v110.74,52.58
  Bottom 0.203: U1.35 105.46,42.42 108.97,42.42 110.74,44.2 v110.74,52.58 110.74,57.4 103.38,64.77 55.63,64.77 53.44,62.59 v44.3,62.59
  Bottom 0.61: U$3.16 102.16,42.47
  Bottom 1.016: 102.16,42.47 U1.35
IO16(RX2)
  Top 0.203: SV3.3 16.08,12.7 24.87,3.91 53.49,3.91 55.27,5.69 103.23,5.69 103.83,6.3 103.83,31.9 103.43,32.31 102.16,32.31 U$3.12
  Bottom 0.203: SV1.IO16 141,32.38 139.7,31.09 108.92,31.09 107.7,32.31 U1.31 105.36,32.26
  Bottom 0.508: 105.36,32.26 U1.31
  Bottom 1.016: U$3.12 105.36,32.26
IO17(TX2)
  Bottom 0.152: 105.48,29.84 105.36,29.72
  Bottom 0.203: 5.21,15.24 SV3.2 | 105.48,29.84 106.81,29.84 108.08,28.58 140.97,28.58 142.24,29.84 SV1.IO17 | U$3.11 101.67,29.28 96.01,29.28 93.22,26.48 93.22,24.89 91.19,22.86 89.15,22.86 88.65,22.35 88.65,16.51 88.39,16.26 73.78,16.26 68.35,21.69 13.36,21.69 6.91,15.24
  Bottom 0.254: 6.91,15.24 5.21,15.24
  Bottom 0.508: 105.36,29.72 U1.30
  Bottom 1.016: U$3.11 105.36,29.72
IO18(SCK/CLK)  (via drill 0.35)
  Top 0.203: v29.39,16 28.45,16.94 21.92,16.94 20.19,18.67 U$5.3 | v118.75,17.14 127.64,17.14 128.91,18.41 142.75,18.41 144.02,19.69 SV1.IO18
  Bottom 0.203: U$3.9 101.09,24.64 98.94,22.48 95,22.48 93.73,21.21 93.73,16.97 91.01,14.25 31.14,14.25 v29.39,16 | U1.28 109.93,24.69 117.47,17.14 v118.75,17.14
  Bottom 0.508: 105.36,24.64 U1.28
  Bottom 1.016: U$3.9 105.36,24.64
IO19(MISO)  (via drill 0.35)
  Top 0.203: v95.73,11.23 95.73,11.28 99.69,15.24 99.69,19.69 U$3.8 | SV1.IO19 144.78,15.88 v117.47,15.88
  Bottom 0.152: 105.48,22.23 U1.27
  Bottom 0.203: U$5.2 22.66,13.16 93.8,13.16 v95.73,11.23 | v117.47,15.88 114.3,15.88 107.95,22.23 105.48,22.23
  Bottom 0.508: 105.36,22.1 U1.27
  Bottom 1.016: U$3.8 105.36,22.1
IO21(SDA)  (via drill 0.35)  (2 unrouted)
  Top 0.152: 98.42,18.06 v98.5,17.98
  Top 0.203: v57.12,28.14 57.15,28.12 57.15,20.32 58.04,19.43 62.48,19.43 63.5,18.41 IC1.13 63.5,16.36 65.02,17.88 71.32,17.88 74.98,14.22 94.74,14.22 | v115.57,41.91 115.57,19.69 112.95,17.07 U1.25
  Top 0.254: v98.5,17.98 94.74,14.22 | EEPROM_1.5 98.42,18.06
  Bottom 0.152: 98.45,18.03 v98.5,17.98
  Bottom 0.203: v115.57,41.91 117.47,43.81 144.78,43.81 SV1.IO21
  Bottom 0.254: U$3.6 101.09,18.03 98.45,18.03 | U$2.SDA 46.28,39.37 | 46.28,39.37 SDA.1 | v57.12,28.14 57.12,32.69 50.44,39.37 46.28,39.37
  Bottom 0.508: 105.36,17.02 U1.25
  Bottom 1.016: U$3.6 105.36,17.02 | R1.1 30.45,40.16 SDA.4 SDA.1
IO22(SCL)  (via drill 0.35)  (2 unrouted)
  Top 0.203: v54.42,27.92 54.51,27.83 54.51,21.13 57.23,18.41 60.33,18.41 60.96,17.78 IC1.12 60.96,14.55 61.82,13.69 85.22,13.69 92,6.91 99.36,6.91 101.85,9.4 U$3.3 | v150.37,27.18 150.37,11.43 149.71,10.77 144.88,10.77 142.24,8.13 129.03,8.13 127.71,9.45 U1.22
  Top 0.254: U$2.SCK 38.86,34.49 SCL.1 | EEPROM_1.6 96.83,27.94 96.32,27.43 96.32,23.37 97.13,22.55 v97.13,18.9
  Bottom 0.203: U$3.3 101.55,9.4 | SV1.IO22 147.19,46.48 149.86,46.48 150.37,45.97 v150.37,27.18
  Bottom 0.254: v54.42,27.92 49.95,32.38 SCL.1 | v97.13,18.9 97.13,13.82 101.55,9.4
  Bottom 0.508: 105.36,9.4 U1.22
  Bottom 1.016: U$3.3 105.36,9.4 | R2.1 28.37,35.26 SCL.4 SCL.1
IO23(MOSI)  (via drill 0.35)
  Top 0.203: v127,8.13 115.82,8.13 114.61,6.91 U1.21
  Bottom 0.203: U$3.2 95.29,13.68 27.22,13.68 U$5.4 | SV1.IO23 141.2,14.61 134.72,8.13 v127,8.13
  Bottom 0.508: 105.36,6.86 U1.21
  Bottom 1.016: U$3.2 105.36,6.86
IO25
  Top 0.152: 149.22,28.58 150.5,29.84
  Top 0.203: U$4.11 137.79,28.58 149.22,28.58 | SV1.IO25 147.32,51.43 149.86,51.43 150.5,50.8 150.5,29.84
  Bottom 0.508: 130.86,24.64 U1.9
  Bottom 1.016: U$4.11 130.86,24.64
IO26(DHT)  (via drill 0.35)
  Top 0.152: U1.10 120.85,27.23 119.38,28.7
  Top 0.203: DHT_EN.1 26.54,40.51 29.54,40.51 31.17,42.14 39.27,42.14 55.85,58.73 v55.88,58.73 | 119.38,28.7 118.01,30.07 118.01,41.78 116.13,43.66 v108.2,43.66
  Bottom 0.152: 144.78,28.58 147.32,28.58 | 130.86,27.18 U1.10
  Bottom 0.203: 147.32,28.58 SV1.IO26 | 144.78,28.58 143.38,27.18 U$4.10 | v108.2,43.66 108.2,43.94 107.95,43.69 100.18,43.69 99.36,44.5 99.36,56.49 92.05,63.8 57.1,63.8 55.88,62.59 v55.88,58.73
  Bottom 1.016: U$4.10 130.86,27.18
IO27
  Bottom 0.203: SV1.IO27 148.59,31.75 147.93,31.09 141.83,31.09 140.46,29.72 136.63,29.72 U$4.9
  Bottom 1.016: U1.11 133.81,29.77 U$4.9
IO32
  Top 0.203: SV1.IO32 147.32,23.49 137.79,23.49 U$4.13
  Bottom 1.016: U1.7 133.81,19.61 U$4.13
IO33
  Top 0.203: SV1.IO33 147.29,26.01 137.77,26.01 U$4.12
  Bottom 1.016: U1.8 133.81,22.15 U$4.12
IO34(MCPINT)  (via drill 0.35)
  Top 0.152: IC1.20 53.34,19.74 55.21,17.87 56.55,17.87 57.15,17.27 57.28,17.14
  Top 0.203: v85.6,10.67 85.6,11.68 84.07,13.21 57.91,13.21 57.28,13.84 57.28,17.14
  Bottom 0.152: v85.6,10.67 85.6,2.82 86.03,2.39 | SV1.IO34 146.43,27.3 | 129.34,14.53 U1.5 130.86,14.48
  Bottom 0.203: 129.34,14.53 125.57,10.78 125.57,5.89 122.07,2.39 86.03,2.39 | U$4.15 139.24,14.48 140.61,15.85 146.91,15.85 147.32,16.26 147.32,26.42 146.43,27.3
  Bottom 1.016: U$4.15 130.86,14.48
IO35
  Top 0.152: SV1.IO35 147.32,20.95
  Top 0.203: 147.32,20.95 147.32,19.05 146.69,18.41 145.41,18.41 144.02,17.02 U$4.14
  Bottom 1.016: U1.6 133.81,17.07 U$4.14
MCP_5V_1
  Top 1.016: MCP_5V_IO.1 82.35,19.43 85.34,22.43 LLS_MCP.J2.1
MCP_5V_2
  Top 1.016: LLS_MCP.J2.2 82.8,23.57 81.84,22.61 80.19,22.61 79.38,21.79 MCP_5V_IO.2
MCP_5V_3
  Top 1.016: LLS_MCP.J2.5 75.18,23.77 76.83,22.12 MCP_5V_IO.3
MCP_5V_4
  Top 1.016: MCP_5V_IO.4 74.3,21.9 72.64,23.55 LLS_MCP.J2.6
N$1
  Bottom 0.254: SG1.- 21.57,65.61 R3.2
N$2
  Bottom 1.016: U1.1 133.81,4.37 U$4.19
N$11
  Top 0.203: IO0.1 92.66,51.49 85.67,51.49 LLS_ESP.J1.1
N$12
  Top 0.203: 20.51,37.97 DHT_EN.2
  Top 0.254: DHT22.2 17.27,34.73 20.51,37.97
  Bottom 0.203: R4.1 17.27,29.97 DHT22.2
N$18
  Top 0.203: IO4.1 92.71,47.61 87.12,47.61 82.91,51.82 LLS_ESP.J1.2
N$21
  Bottom 0.254: SG1.+ 17.78,55.68 BUZ_EN.1
N$23
  Top 0.203: IO13.1 92.71,44.53 82.6,44.53 75.31,51.82 LLS_ESP.J1.5
N$24
  Top 0.203: LLS_ESP.J1.6 73.38,51.82 82.04,43.16 88.19,43.16 88.21,43.18 89.53,43.18 IO14.1
ONBOARD_LEDS
  Top 0.508: ESP_5V_IO.1 95,36.47 93.67,37.8 92.05,37.8 88.19,41.66 LLS_ESP.J2.1
  Bottom 0.203: LED_DATA.1 67.31,52.7 67.31,50.55 71.88,45.97 81.03,45.97 LLS_ESP.J2.1
RX0
  Bottom 0.152: 124.53,12.65 107.29,12.65 U1.24
  Bottom 0.203: SV1.RX0 142.12,20.84 129.93,20.84 127.84,19.27 127.85,15.97 124.53,12.65
  Bottom 0.508: 105.36,14.48 U1.24
  Bottom 1.016: U$3.5 105.36,14.48
SD0  (via drill 0.35)
  Top 0.203: U1.37 117.35,47.55 v117.42,47.47
  Bottom 0.203: v117.42,47.47 128.6,47.47 129.82,46.25 142.37,46.25 145.03,48.92 147.34,48.92 SV1.SD0
  Bottom 0.61: 102.16,47.55 U$3.18
  Bottom 1.016: U1.37 102.16,47.55
SD1  (via drill 0.35)
  Top 0.152: 114.76,45.01 v114.81,44.96
  Top 0.203: SV1.SD1 147.19,46.23 v128.27,46.23 | U1.36 114.76,45.01
  Bottom 0.203: v114.81,44.96 127,44.96 v128.27,46.23
  Bottom 0.61: U$3.17 102.16,45.01
  Bottom 1.016: 102.16,45.01 U1.36
SD2
  Bottom 0.203: U$4.4 143.76,42.42 145.03,41.15 146.56,41.15 147.32,41.91 147.32,43.94 148.46,45.09 SV1.SD2
  Bottom 0.508: 133.81,42.47 U$4.4
  Bottom 1.016: U1.16 133.81,42.47
SD3
  Top 0.203: SV1.SD3 147.45,43.69 136.91,43.69 135.64,44.96 U$4.3
  Bottom 0.508: 133.81,45.01 U$4.3
  Bottom 1.016: U1.17 133.81,45.01
SENSOR_VN
  Top 0.203: SV1.SENSOR_VN 148.59,19.13 147.32,17.86 147.32,13.82 146.91,13.41 135.33,13.41 U$4.16
  Bottom 1.016: U1.4 133.81,11.99 U$4.16
SENSOR_VP  (via drill 0.35)
  Top 0.203: v137.92,9.4 U$4.17
  Bottom 0.152: SV1.SENSOR_VP 148.59,16.51 147.32,15.24 147.32,13.97
  Bottom 0.203: 147.32,13.97 146.81,13.46 141.99,13.46 v137.92,9.4
  Bottom 1.016: U1.3 133.81,9.45 U$4.17
TX0
  Bottom 0.152: 128.91,15.88 138.43,15.88
  Bottom 0.203: U1.23 106.05,11.36 124.39,11.36 128.91,15.88 | 138.43,15.88 144.78,22.23 SV1.TX0
  Bottom 0.508: 105.36,11.94 U1.23
  Bottom 1.016: U$3.4 105.36,11.94

### Text on the board
tPlace: BGHPCB32 | PWR & I2C | 330R | v1.1 | July 2020 | LEDSTRIP / 8x WS2812B / 144 LED / METER | 1000uF | USB-B | USB | 5V | 4k7 | 3V3 | GND | 5V IO ESP | 5V | ESP32 / DEVKITC | 10k | EEPROM | 24LC512 | GND | JCLJCLJCLJCL | NEXTION | MCP - GPA[7..0] | ANTENNA
tNames: 100nf | MCP23017 | GPB7 | GPB6 | GPB5 | GPB4 | IO14 | IO13 | IO4 | IO0 | 100nf | GPA7 | GPA6 | GPA5 | GPA4 | GPA3 | GPA2 | GPA1 | GPA0